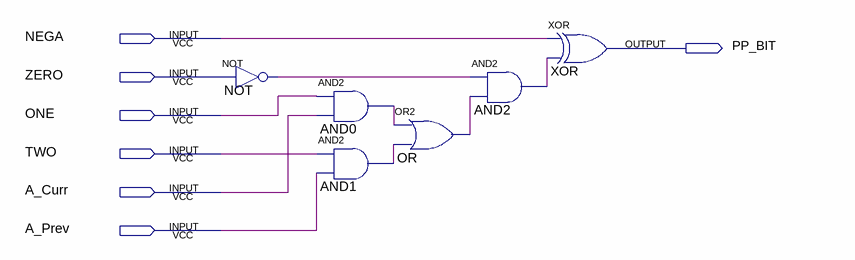
[diagram p0: schematic sheet]
// Quartus schematic PP_UNIT.bdf as structural Verilog: 6 symbols, 7 pins
module PP_UNIT (
  input  NEGA,
  input  ZERO,
  input  ONE,
  input  TWO,
  input  A_Curr,
  input  A_Prev,
  output PP_BIT
);

  wire AND0_out, AND1_out, AND2_out, NOT_out, OR_out;

  not NOT (NOT_out, ZERO);
  and AND0 (AND0_out, ONE, A_Curr);
  and AND1 (AND1_out, TWO, A_Prev);
  or OR (OR_out, AND0_out, AND1_out);
  and AND2 (AND2_out, NOT_out, OR_out);
  xor XOR (PP_BIT, NEGA, AND2_out);
endmodule
